# Altium schematic sheet rl78l1a_smart_blood_pressure_monitor_sch2.SchDoc: RL78/L1A Smart Blood Pressure Monitor
size A4; Date: 2017/6/1; Author: Renesas Electronics; SheetNumber: 2; SheetTotal: 2; Company: Renesas Electronics (China) Co.,Ltd; Rev: Rev 1.00
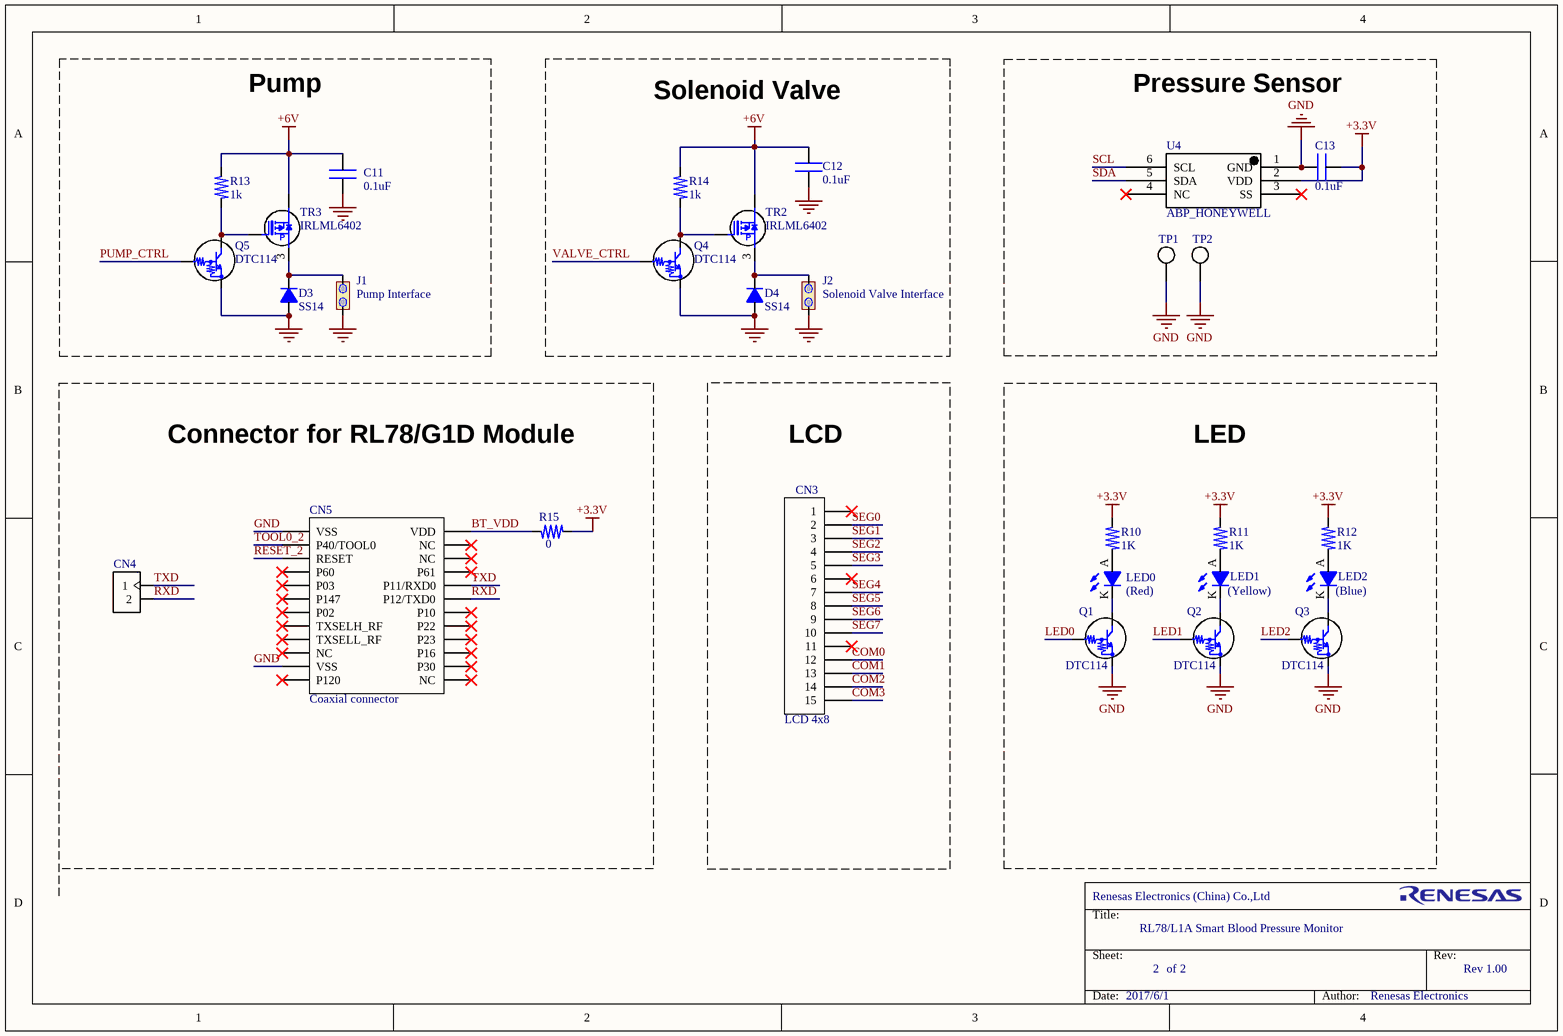
[diagram p0: rl78l1a_smart_blood_pressure_monitor_sch2.SchDoc]

## Parts
C11  0.1uF  [0805]
C12  0.1uF  [0805]
C13  0.1uF  [0805]
CN3  LCD 4x8  [LCD 4X8]
CN4  CON 2PIN A  [JMP-2 A]  (value not drawn)
CN5  Coaxial connector  [CRS5001 - 24]
D3  SS14  [D1N]
D4  SS14  [D1N]
J1  JMP 2PIN  [JMP-2 A]  (value not drawn)
J2  JMP 2PIN  [JMP-2 A]  (value not drawn)
LED0  (no value)  [LED 0603]
LED1  (no value)  [LED 0603]
LED2  (no value)  [LED 0603]
Q1  DTC114  [SOT-23-3 A]
Q2  DTC114  [SOT-23-3 A]
Q3  DTC114  [SOT-23-3 A]
Q4  DTC114  [SOT-23-3 A]
Q5  DTC114  [SOT-23-3 A]
R10  1K  [0603]
R11  1K  [0603]
R12  1K  [0603]
R13  1k  [0805]
R14  1k  [0805]
R15  0  [0805]
TP1  (no value)  [TP A]
TP2  (no value)  [TP A]
TR2  IRLML6402  [SOT-23-3 B]
TR3  IRLML6402  [SOT-23-3 B]
U4  ABP_HONEYWELL  [ABP-DIP6]

## Blocks framed on the sheet
Pump: C11 D3 J1 Q5 R13 TR3
Pressure Sensor: C13 TP1 TP2 U4
LCD: CN3
LED: LED0-LED2 Q1-Q3 R10-R12

## Nets
+3.3V: C13.1 R10.2 R11.2 R12.2 R15.1 U4.2(VDD)
+6V: C11.1 C12.1 R13.1 R14.1 TR2.2(S) TR3.2(S)
GND: C11.2 C12.2 C13.2 CN5.1(VSS) CN5.21(VSS) D3.A D4.A J1.2 J2.2 Q1.E Q2.E Q3.E Q4.E Q5.E TP1.1(TP) TP2.1(TP) U4.1(GND)
BT_VDD: CN5.2(VDD) R15.2
COM0: CN3.12
COM1: CN3.13
COM2: CN3.14
COM3: CN3.15
LED0: Q1.B
LED1: Q2.B
LED2: Q3.B
PUMP_CTRL: Q5.B
RESET_2: CN5.5(RESET)
RXD: CN4.2 CN5.12(P12/TXD0)
SCL: U4.6(SCL)
SDA: U4.5(SDA)
SEG0: CN3.2
SEG1: CN3.3
SEG2: CN3.4
SEG3: CN3.5
SEG4: CN3.7
SEG5: CN3.8
SEG6: CN3.9
SEG7: CN3.10
TOOL0_2: CN5.3(P40/TOOL0)
TXD: CN4.1 CN5.10(P11/RXD0)
VALVE_CTRL: Q4.B
NetD3_K: D3.K J1.1 TR3.3(D)
NetD4_K: D4.K J2.1 TR2.3(D)
NetLED0_A: LED0.A R10.1
NetLED0_K: LED0.K Q1.C
NetLED1_A: LED1.A R11.1
NetLED1_K: LED1.K Q2.C
NetLED2_A: LED2.A R12.1
NetLED2_K: LED2.K Q3.C
NetQ4_C: Q4.C R14.2 TR2.1(G)
NetQ5_C: Q5.C R13.2 TR3.1(G)

Not connected (* = marked no-connect by the designer): CN3 1* 6* 11*; CN5 4(NC)* 6(NC)* 7(P60)* 8(P61)* 9(P03)* 11(P147)* 13(P02)* 14(P10)* 15(TXSELH_RF)* 16(P22)* 17(TXSELL_RF)* 18(P23)* 19(NC)* 20(P16)* 22(P30)* 23(P120)* 24(NC)*; U4 3(SS)* 4(NC)*

## Notes on the sheet
- Solenoid Valve
- (near J1) Pump Interface
- (near J2) Solenoid Valve Interface
- Connector for RL78/G1D Module
- (near LED0) (Red)
- (near LED1) (Yellow)
- (near LED2) (Blue)
- Title:
- Sheet:
- of
- Rev:
- Date:
- Author:
- (in symbol IRLML5103) P

## Library data of the parts
C11 C12 = CAP: Value: 104
C13 = CAP
D3 D4 = 1SS404
LED0-LED2 = LED
R10-R15 = RES
TP1 TP2 = TP
TR2 TR3 = IRLML5103
CN5 = Coaxial connector: LatestRevisionDate: 17-Jul-2002; LatestRevisionNote: Re-released for DXP Platform.; Publisher: Altium Limited